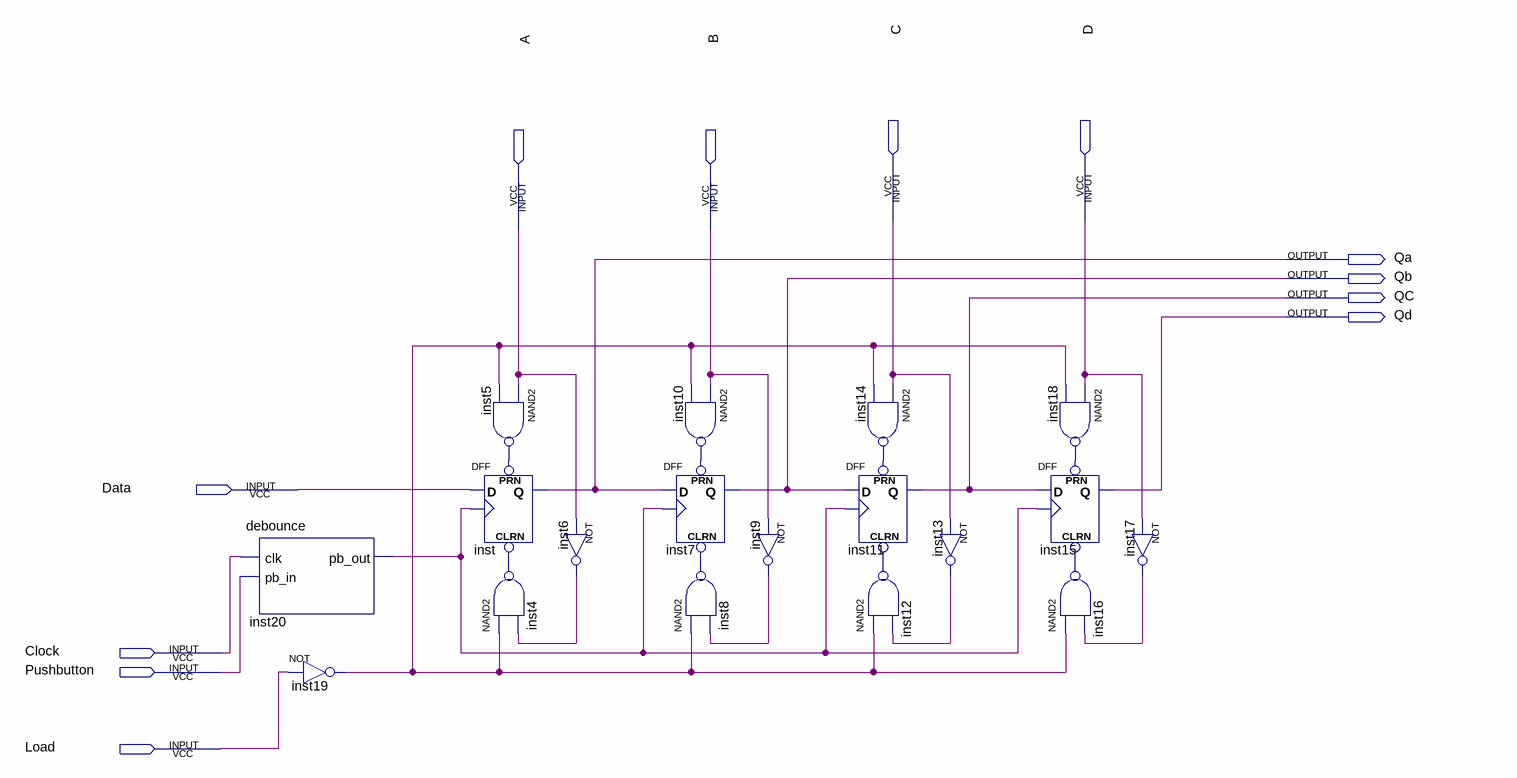
[diagram p0: schematic sheet]
// Quartus schematic Lsr4_sr.bdf as structural Verilog: 18 symbols, 12 pins
module Lsr4_sr (
  input  C,
  input  D,
  input  A,
  input  B,
  input  Data,
  input  Clock,
  input  Pushbutton,
  input  Load,
  output Qa,
  output Qb,
  output QC,
  output Qd
);

  wire inst4_out, inst5_out, inst6_out, inst8_out, inst9_out, inst10_out, inst12_out, inst13_out, inst14_out,
       inst16_out, inst17_out, inst18_out, inst19_out, inst20_pb_out;

  debounce inst20 (.clk(Clock), .pb_in(Pushbutton), .pb_out(inst20_pb_out));
  not inst19 (inst19_out, Load);
  nand inst5 (inst5_out, A, inst19_out);
  DFF inst (.CLRN(inst4_out), .CLK(inst20_pb_out), .D(Data), .PRN(inst5_out), .Q(Qa));
  nand inst4 (inst4_out, inst19_out, inst6_out);
  not inst6 (inst6_out, A);
  DFF inst7 (.CLRN(inst8_out), .CLK(inst20_pb_out), .D(Qa), .PRN(inst10_out), .Q(Qb));
  nand inst10 (inst10_out, B, inst19_out);
  nand inst8 (inst8_out, inst19_out, inst9_out);
  not inst9 (inst9_out, B);
  nand inst14 (inst14_out, C, inst19_out);
  DFF inst11 (.CLRN(inst12_out), .CLK(inst20_pb_out), .D(Qb), .PRN(inst14_out), .Q(QC));
  nand inst12 (inst12_out, inst19_out, inst13_out);
  not inst13 (inst13_out, C);
  nand inst18 (inst18_out, D, inst19_out);
  DFF inst15 (.CLRN(inst16_out), .CLK(inst20_pb_out), .D(QC), .PRN(inst18_out), .Q(Qd));
  nand inst16 (inst16_out, inst19_out, inst17_out);
  not inst17 (inst17_out, D);
endmodule
